# Altium schematic sheet Microprocessor.SchDoc
size A4; SheetNumber: 1; SheetTotal: 1
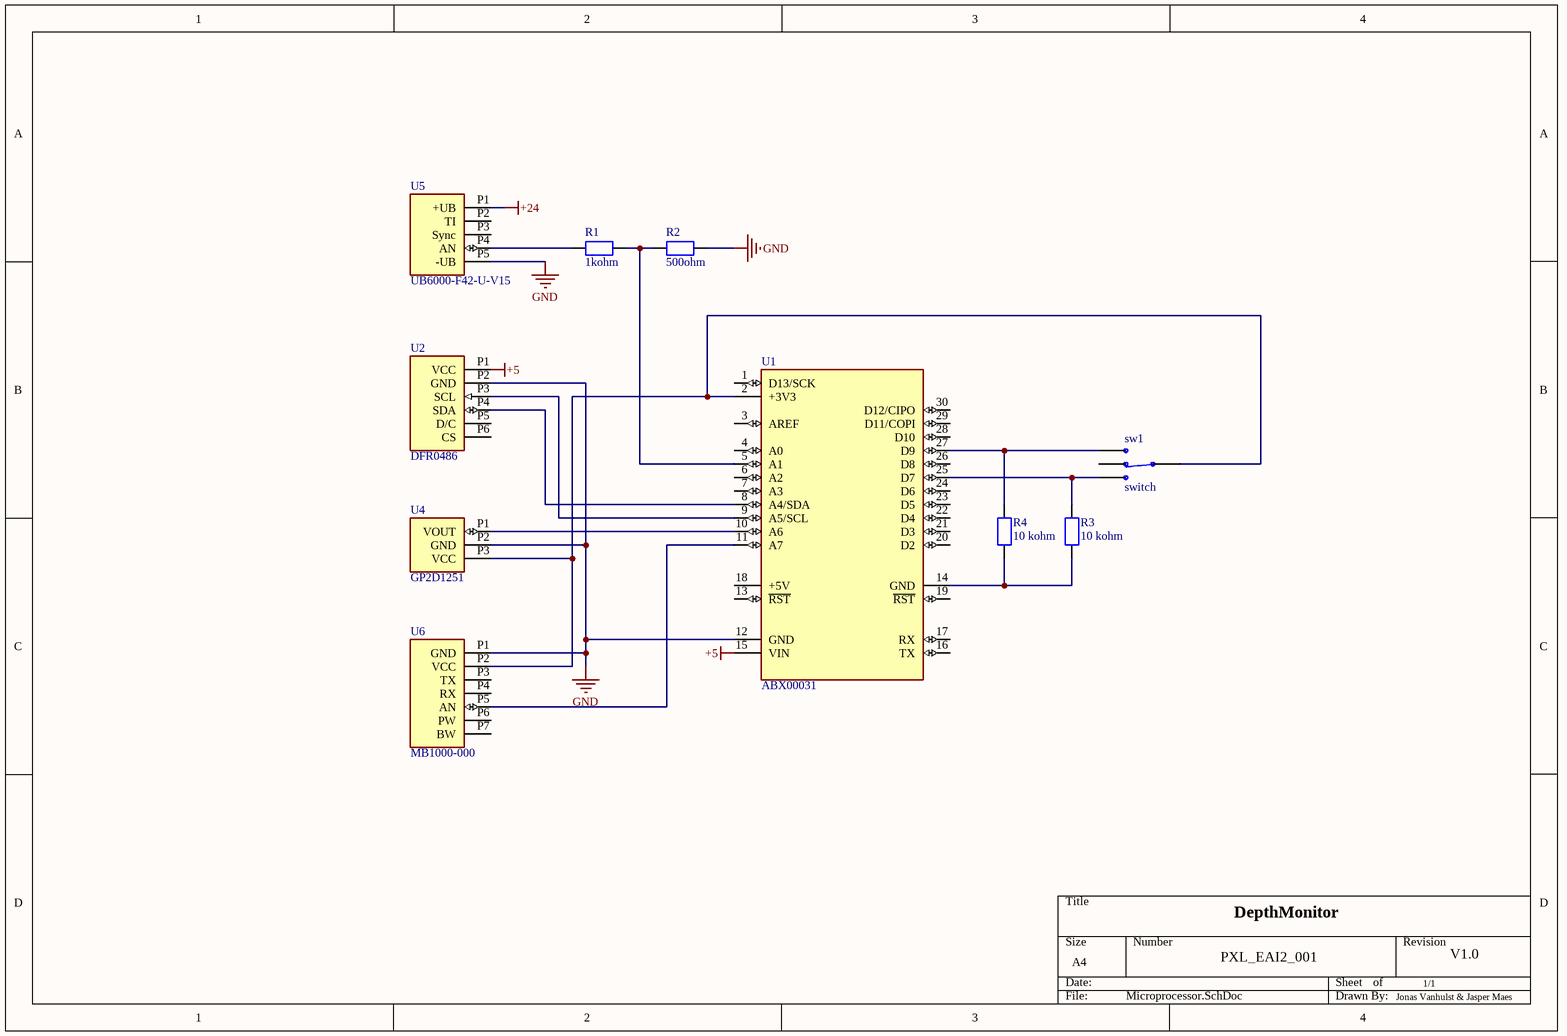
[diagram p0: Microprocessor.SchDoc]

## Parts
R1  1kohm  [Weerstand 1M ohm]
R2  500ohm  [Weerstand 1M ohm]
R3  10 kohm  [Weerstand 1M ohm]
R4  10 kohm  [Weerstand 1M ohm]
sw1  switch
U1  ABX00031  [MODULE_ABX00030]
U2  DFR0486  [GP2DXX]
U4  GP2D1251  [GP2DXX]
U5  UB6000-F42-U-V15  [GP2DXX]
U6  MB1000-000  [GP2DXX]

## Nets
+5: U1.15(VIN) U2.P1(VCC)
+24: U5.P1(+UB)
GND: R2.2 U1.12(GND) U2.P2(GND) U4.P2(GND) U5.P5(-UB) U6.P1(GND)
NetR1_1: R1.1 U5.P4(AN)
NetR1_2: R1.2 R2.1 U1.5(A1)
NetR3_1: R3.1 R4.1 U1.14(GND)
NetR3_2: R3.2 sw1.?2 U1.25(D7)
NetR4_2: R4.2 sw1.?3 U1.27(D9)
Netsw1_?4: sw1.?4 U1.2(+3V3) U4.P3(VCC) U6.P2(VCC)
NetU1_8: U1.8(A4/SDA) U2.P4(SDA)
NetU1_9: U1.9(A5/SCL) U2.P3(SCL)
NetU1_10: U1.10(A6) U4.P1(VOUT)
NetU1_11: U1.11(A7) U6.P5(AN)

Not connected (* = marked no-connect by the designer): sw1 ?1; U1 1(D13/SCK) 3(AREF) 4(A0) 6(A2) 7(A3) 13(~{RST}) 16(TX) 17(RX) 18(+5V) 19(~{RST}) 20(D2) 21(D3) 22(D4) 23(D5) 24(D6) 26(D8) 28(D10) 29(D11/COPI) 30(D12/CIPO); U2 P5(D/C) P6(CS); U5 P2(TI) P3(Sync); U6 P3(TX) P4(RX) P6(PW) P7(BW)

## Notes on the sheet
- DepthMonitor
- PXL_EAI2_001
- 1/1
- V1.0
- Jonas Vanhulst & Jasper Maes

## Library data of the parts
R1 = Weerstand 1 kohm: Manufacturer: Vishay Dale; Part Number: CRCW0805100RFKEA
R2 = Weerstand 500 ohm: Manufacturer: Vishay Dale; Part Number: CRCW0805100RFKEA
R3 R4 = Weerstand 10 kohm: Manufacturer: Vishay Dale; Part Number: CRCW0805100RFKEA
U1 = ABX00031: Arduino Nano 33 BLE; MP: ABX00030; Price: None; Value: *; Purchase-URL: https://pricing.snapeda.com/search/part/ABX00030/?ref=eda; Package: None; Check_prices: https://www.snapeda.com/parts/ABX00030/Arduino/view-part/?ref=eda; SnapEDA_Link: https://www.snapeda.com/parts/ABX00030/Arduino/view-part/?ref=snap; Availability: In Stock; MF: Arduino
U2 = DFR0486: 0.96" 128x64 OLED(V1.0) display DFROBOT; MP: GP2D120; MF: Sharp; Package: None; Check_prices: https://www.snapeda.com/parts/GP2D120/Sharp%20Microelectronics/view-part/569732/?ref=eda; Value: *; SnapEDA_Link: https://www.snapeda.com/parts/GP2D120/Sharp%20Microelectronics/view-part/569732/?ref=snap; Availability: Bad; Price: None
U4 = GP2D1251: SENSOR OPTICAL ANALOG; MP: GP2D120; MF: Sharp; Package: None; Check_prices: https://www.snapeda.com/parts/GP2D120/Sharp%20Microelectronics/view-part/569732/?ref=eda; Value: *; SnapEDA_Link: https://www.snapeda.com/parts/GP2D120/Sharp%20Microelectronics/view-part/569732/?ref=snap; Availability: Bad; Price: None
U5 = UB6000-F42-U-V15: Ultrasonic sensor; MP: GP2D120; MF: Sharp; Package: None; Check_prices: https://www.snapeda.com/parts/GP2D120/Sharp%20Microelectronics/view-part/569732/?ref=eda; Value: *; SnapEDA_Link: https://www.snapeda.com/parts/GP2D120/Sharp%20Microelectronics/view-part/569732/?ref=snap; Availability: Bad; Price: None
U6 = MB1000-000: Analog ultrasonic sensor; MP: GP2D120; MF: Sharp; Package: None; Check_prices: https://www.snapeda.com/parts/GP2D120/Sharp%20Microelectronics/view-part/569732/?ref=eda; Value: *; SnapEDA_Link: https://www.snapeda.com/parts/GP2D120/Sharp%20Microelectronics/view-part/569732/?ref=snap; Availability: Bad; Price: None